# EAGLE schematic Ubo_side_v1.4 (EAGLE 9.6.2)
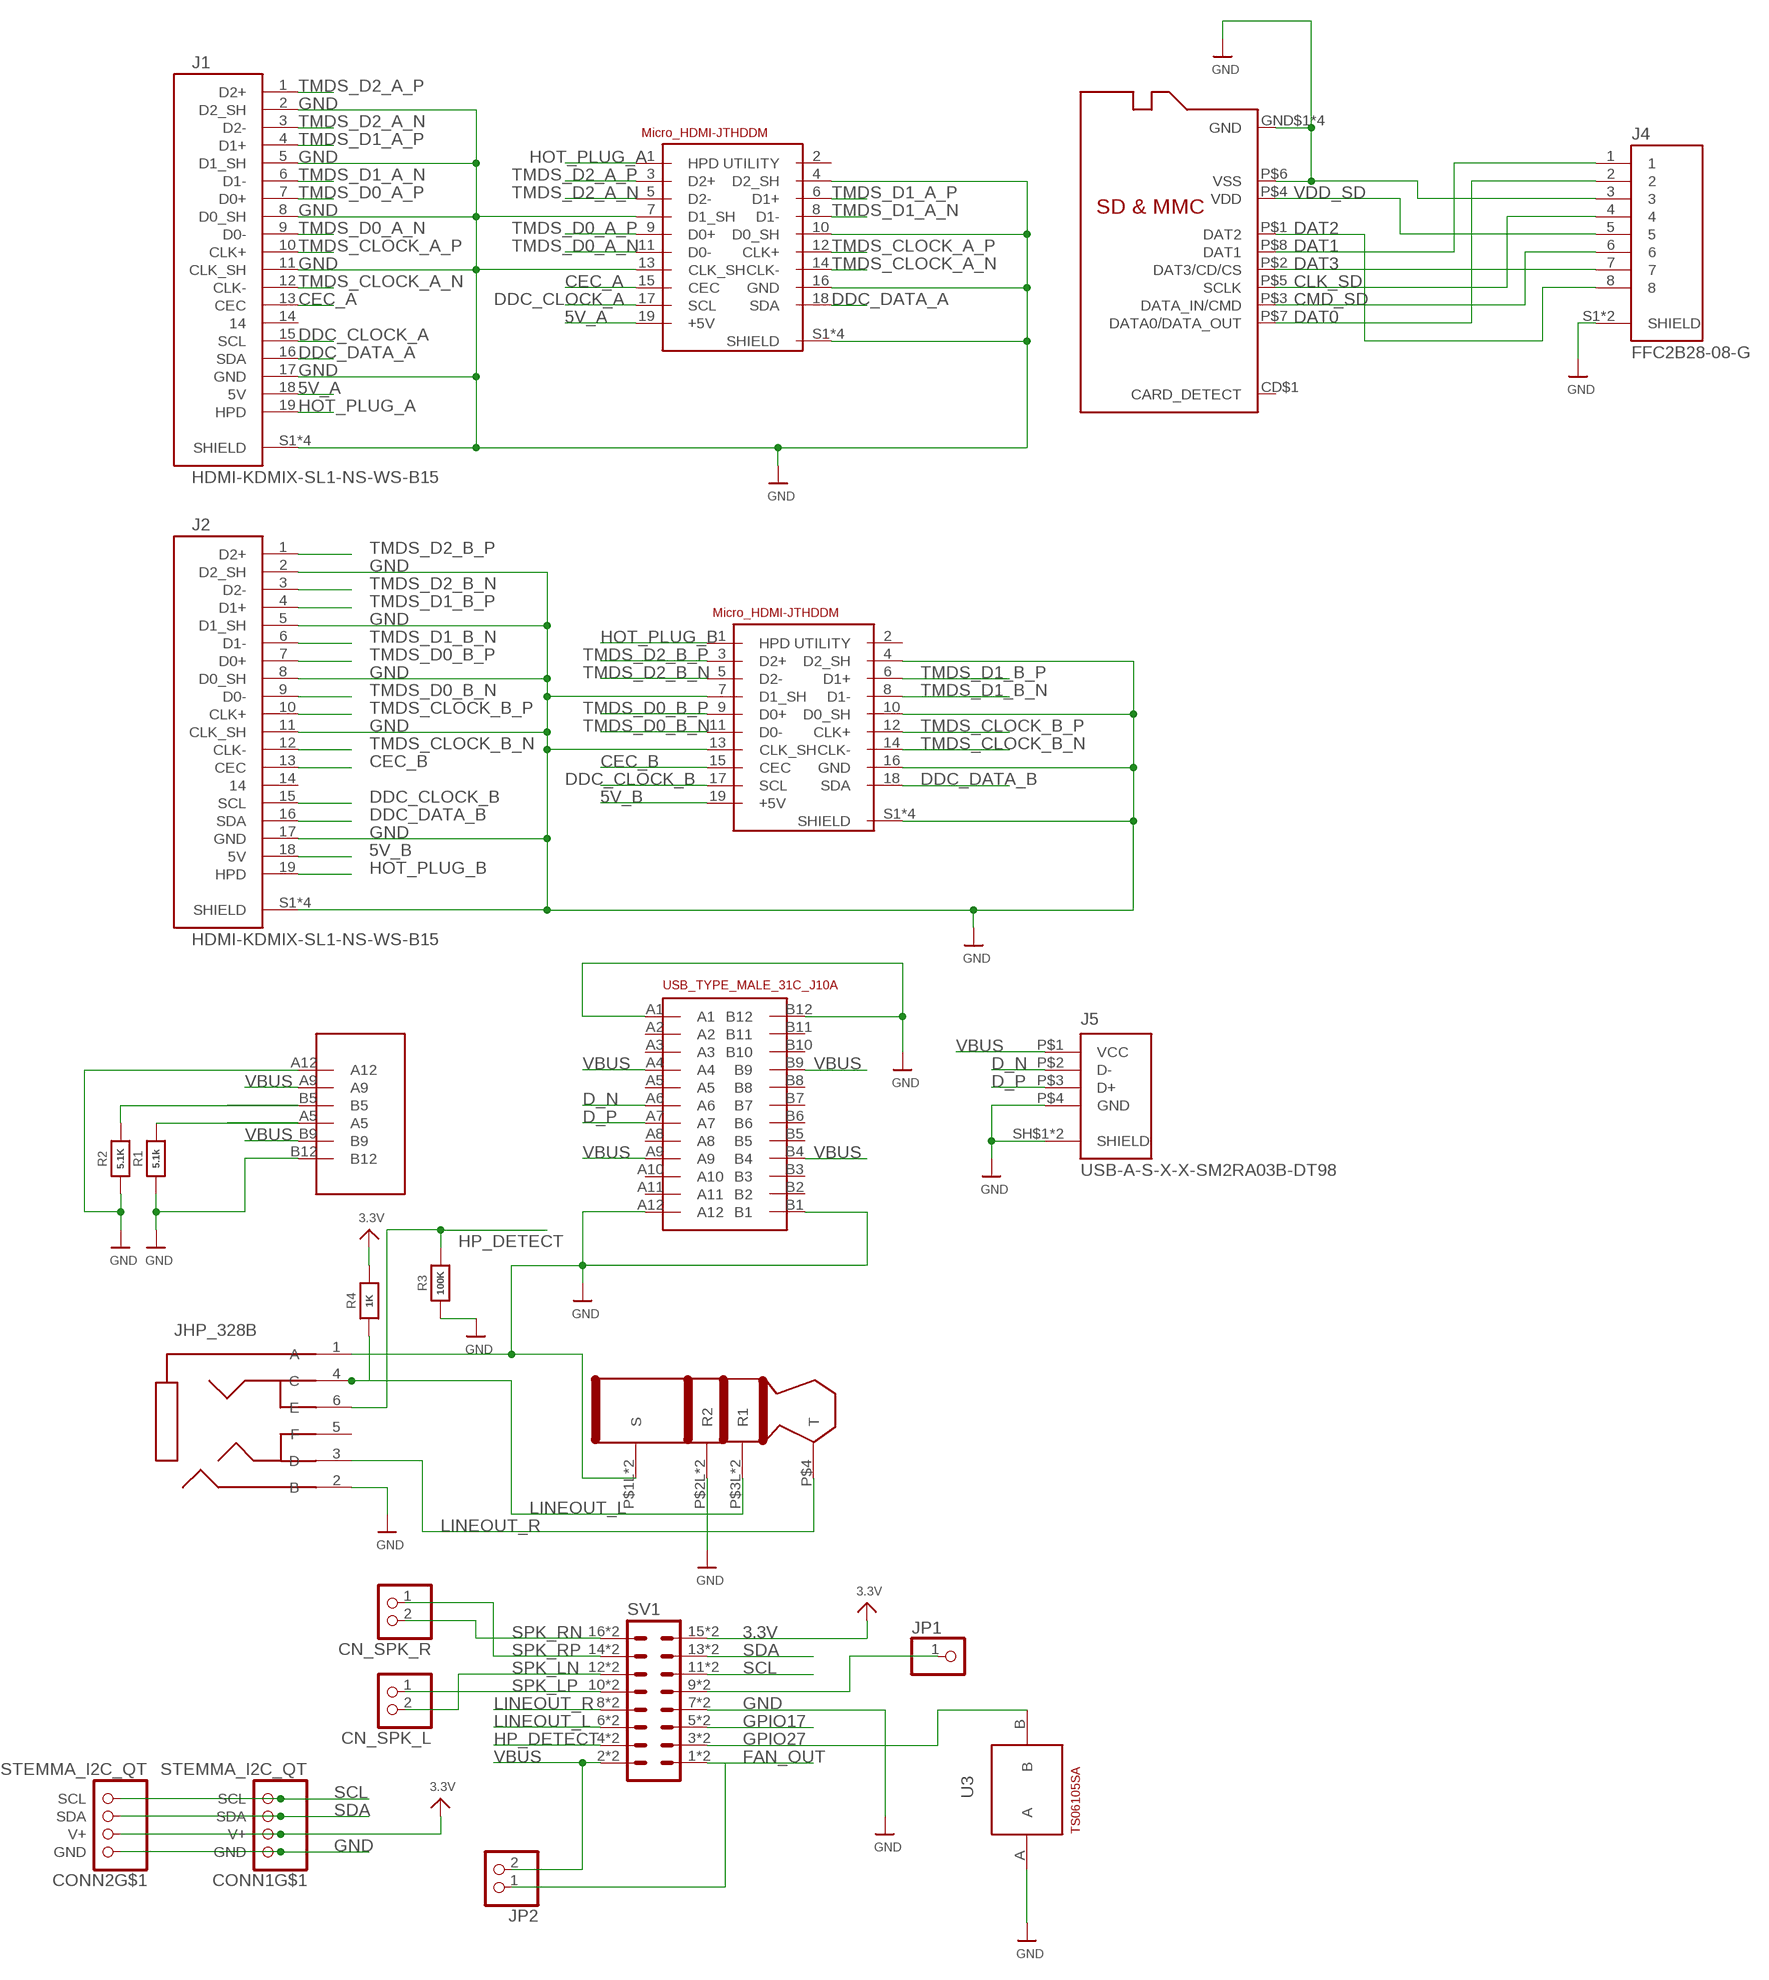
[diagram p0: schematic, sheet 1]

## Parts
AUD_CON  AUDIO_3.5MMJACK_MALE  [AUDIO_3.5MM_JACK_MALE]
CN_SPK_L  JST_2PIN-SMT  [JST-PH-2-SMT]
CN_SPK_R  JST_2PIN-SMT  [JST-PH-2-SMT]
CONN1  STEMMA_I2C_QT  [JST_SH4]
CONN2  STEMMA_I2C_QT  [JST_SH4]
J1  HDMI-KDMIX-SL1-NS-WS-B15  [CONN_KDMIX-SL1-NS-WS-B15]
J2  HDMI-KDMIX-SL1-NS-WS-B15  [CONN_KDMIX-SL1-NS-WS-B15]
J4  FFC2B28-08-G  [GCT_FFC2B28-08-G]
J5  USB-A-S-X-X-SM2RA03B-DT98  [USB-A-RA03B-DT98]
JP1  PINHD-1X1  [1X01]
JP2  PINHD-1X2/90  [1X02/90]
MICROHDMI1  MICRO_HDMI_JTHDDM  [MICRO_HDMI_JTHDDM]
MICROHDMI2  MICRO_HDMI_JTHDDM  [MICRO_HDMI_JTHDDM]
R1  5.1k  RESISTOR_0603  [_0603]
R2  5.1K  RESISTOR_0603  [_0603]
R3  100K  RESISTOR_0603  [_0603]
R4  1K  RESISTOR_0603  [_0603]
SV1  MA08X2-FEMALE  [MA08X2-FEMALE]
U1  AUDIO_SOCKET_JHP_328BPJ-3160  [PJ-3160]
U2  USB-20C-F-06CD-1  [USB_20C_F_60CD]
U3  TS06105SA  [TS-06105SA-1]
U4  MICROSDTF01-H1.8  [MICROSDTF-01-H1.8]
USBC  USB_TYPE_MALE_31C_J10C  [USB_TYPE_MALE_31C_J10A]

## Nets
3.3V: CONN1.2(V+) CONN2.2(V+) R4.2 SV1.15 SV1.P$15
5V_A: J1.18(5V) MICROHDMI1.19(+5V)
5V_B: J2.18(5V) MICROHDMI2.19(+5V)
A5: R1.2 U2.A5
B5: R2.2 U2.B5
CEC_A: J1.13(CEC) MICROHDMI1.15(CEC)
CEC_B: J2.13(CEC) MICROHDMI2.15(CEC)
CLK_SD [SD CARD]: J4.4 U4.P$5(SCLK)
CMD_SD [SD CARD]: J4.6 U4.P$3(DATA_IN/CMD)
D_N: J5.P$2(D-) USBC.A6
D_P: J5.P$3(D+) USBC.A7
DAT0 [SD CARD]: J4.2 U4.P$7(DATA0/DATA_OUT)
DAT1 [SD CARD]: J4.1 U4.P$8(DAT1)
DAT2 [SD CARD]: J4.8 U4.P$1(DAT2)
DAT3 [SD CARD]: J4.7 U4.P$2(DAT3/CD/CS)
DDC_CLOCK_A: J1.15(SCL) MICROHDMI1.17(SCL)
DDC_CLOCK_B: J2.15(SCL) MICROHDMI2.17(SCL)
DDC_DATA_A: J1.16(SDA) MICROHDMI1.18(SDA)
DDC_DATA_B: J2.16(SDA) MICROHDMI2.18(SDA)
FAN_OUT: JP2.1 SV1.1 SV1.P$1
GND: AUD_CON.P$1L(S) AUD_CON.P$1R(S) AUD_CON.P$2L(R2) AUD_CON.P$2R(R2) CONN1.1(GND) CONN2.1(GND) J1.2(D2_SH) J1.5(D1_SH) J1.8(D0_SH) J1.11(CLK_SH) J1.17(GND) J1.S1(SHIELD) J1.S2(SHIELD) J1.S3(SHIELD) J1.S4(SHIELD) J2.2(D2_SH) J2.5(D1_SH) J2.8(D0_SH) J2.11(CLK_SH) J2.17(GND) J2.S1(SHIELD) J2.S2(SHIELD) J2.S3(SHIELD) J2.S4(SHIELD) J4.3 J4.S1(SHIELD) J4.S2(SHIELD) J5.P$4(GND) J5.SH$1(SHIELD) J5.SH$2(SHIELD) MICROHDMI1.4(D2_SH) MICROHDMI1.7(D1_SH) MICROHDMI1.10(D0_SH) MICROHDMI1.13(CLK_SH) MICROHDMI1.16(GND) MICROHDMI1.S1(SHIELD) MICROHDMI1.S2(SHIELD) MICROHDMI1.S3(SHIELD) MICROHDMI1.S4(SHIELD) MICROHDMI2.4(D2_SH) MICROHDMI2.7(D1_SH) MICROHDMI2.10(D0_SH) MICROHDMI2.13(CLK_SH) MICROHDMI2.16(GND) MICROHDMI2.S1(SHIELD) MICROHDMI2.S2(SHIELD) MICROHDMI2.S3(SHIELD) MICROHDMI2.S4(SHIELD) R1.1 R2.1 R3.1 SV1.7 SV1.P$7 U1.1(A) U1.2(B) U2.A12 U2.B12 U3.A U4.GND$1(GND) U4.GND$2(GND) U4.GND$3(GND) U4.GND$4(GND) U4.P$6(VSS) USBC.A1 USBC.A12 USBC.B1 USBC.B12
GPIO17: SV1.5 SV1.P$5
GPIO27: SV1.3 SV1.P$3 U3.B
HOT_PLUG_A: J1.19(HPD) MICROHDMI1.1(HPD)
HOT_PLUG_B: J2.19(HPD) MICROHDMI2.1(HPD)
HP_DETECT: R3.2 SV1.4 SV1.P$4 U1.6(E)
LINEOUT_L: AUD_CON.P$3L(R1) AUD_CON.P$3R(R1) R4.1 SV1.6 SV1.P$6 U1.4(C)
LINEOUT_R: AUD_CON.P$4(T) SV1.8 SV1.P$8 U1.3(D)
N$1: JP1.1 SV1.9 SV1.P$9
SCL: CONN1.4(SCL) CONN2.4(SCL) SV1.11 SV1.P$11
SDA: CONN1.3(SDA) CONN2.3(SDA) SV1.13 SV1.P$13
SPK_LN: CN_SPK_L.2 SV1.12 SV1.P$12
SPK_LP: CN_SPK_L.1 SV1.10 SV1.P$10
SPK_RN: CN_SPK_R.2 SV1.16 SV1.P$16
SPK_RP: CN_SPK_R.1 SV1.14 SV1.P$14
TMDS_CLOCK_A_N: J1.12(CLK-) MICROHDMI1.14(CLK-)
TMDS_CLOCK_A_P: J1.10(CLK+) MICROHDMI1.12(CLK+)
TMDS_CLOCK_B_N: J2.12(CLK-) MICROHDMI2.14(CLK-)
TMDS_CLOCK_B_P: J2.10(CLK+) MICROHDMI2.12(CLK+)
TMDS_D0_A_N: J1.9(D0-) MICROHDMI1.11(D0-)
TMDS_D0_A_P: J1.7(D0+) MICROHDMI1.9(D0+)
TMDS_D0_B_N: J2.9(D0-) MICROHDMI2.11(D0-)
TMDS_D0_B_P: J2.7(D0+) MICROHDMI2.9(D0+)
TMDS_D1_A_N: J1.6(D1-) MICROHDMI1.8(D1-)
TMDS_D1_A_P: J1.4(D1+) MICROHDMI1.6(D1+)
TMDS_D1_B_N: J2.6(D1-) MICROHDMI2.8(D1-)
TMDS_D1_B_P: J2.4(D1+) MICROHDMI2.6(D1+)
TMDS_D2_A_N: J1.3(D2-) MICROHDMI1.5(D2-)
TMDS_D2_A_P: J1.1(D2+) MICROHDMI1.3(D2+)
TMDS_D2_B_N: J2.3(D2-) MICROHDMI2.5(D2-)
TMDS_D2_B_P: J2.1(D2+) MICROHDMI2.3(D2+)
VBUS: J5.P$1(VCC) JP2.2 SV1.2 SV1.P$2 U2.A9 U2.B9 USBC.A4 USBC.A9 USBC.B4 USBC.B9
VDD_SD: J4.5 U4.P$4(VDD)
Unconnected: CONN1.MT1(MT) CONN1.MT2(MT) CONN2.MT1(MT) CONN2.MT2(MT) J1.14 J2.14 MICROHDMI1.2(UTILITY) MICROHDMI2.2(UTILITY) U1.5(F) U4.CD$1(CARD_DETECT) USBC.A2 USBC.A3 USBC.A5 USBC.A8 USBC.A10 USBC.A11 USBC.B2 USBC.B3 USBC.B5 USBC.B6 USBC.B7 USBC.B8 USBC.B10 USBC.B11

## Library data of the parts
AUD_CON = Uno:AUDIO_3.5MMJACK_MALE
CN_SPK_L CN_SPK_R = Uno:JST_2PIN: JST 2-Pin Connectors of various flavors SMT-RA (S2B-PH-SM4) 4UConnector #17311 SMT (B2B-PH-SM4) THM-RA (S2B-PH) THM (B2B-PH)
CONN1 CONN2 = Uno:STEMMA_I2C
J1 J2 = Uno:HDMI-KDMIX-SL1-NS-WS-B15: Conn HDMI RCP 19 POS 1.15mm Solder RA Thru-Hole 19 Terminal 1 Port; COST: $0.4; DESCRIPTION: HDMI Receptacle Connector 19 Position Through Hole, Right Angle; DIGI-KEY_PART_NUMBER: 2092-KDMIX-SL1-NS-WS-B15-ND; MF: Kycon; MF-ALT: Xiamen Jibeili Electronics; MP: KDMIX-SL1-NS-WS-B15; PACKAGE: None
J4 = Uno:FFC2B28-08-G: FPC 0.5mm Pitch, Side entry, Dual contact, SMT, Height 1mm, Back Flip Check prices <https://pricing.snapeda.com/parts/FFC2B28-08-G/Global%20Connector%20Technology/view-part?ref=eda>; AVAILABILITY: In Stock; DESCRIPTION: 8 Position FFC, FPC Connector Contacts, Top and Bottom 0.020 (0.50mm) Surface Mount, Right Angle; MF: Global Connector Technology; MP: FFC2B28-08-G; PACKAGE: None; PRICE: None; PURCHASE-URL: https://pricing.snapeda.com/search/part/FFC2B28-08-G/?ref=eda
J5 = Uno:USB-A-S-X-X-SM2: USB-A (USB TYPE-A) USB 2.0 Receptacle Connector 4 Position Surface Mount, Right Angle; Through Hole
JP1 = adafruit:PINHD-1X1: Pin header 1x1 for 0.1" spacing With round pins
JP2 = pinhead:PINHD-1X2: PIN HEADER
MICROHDMI1 MICROHDMI2 = Uno:MICRO_HDMI_JTHDDM: Micro HDMI Male connector, 19 Pins, Board Edge Mount; MF: MTCONN ELECTRONICS CO.,LTD; MPN: JTHDDM_0200D1SP79
R1-R4 = Uno:RESISTOR: Resistors For new designs, use the packages preceded by an '_' character since they are more reliable: The following footprints should be used on most boards: _0402 - Standard footprint for regular board layouts _0603 - Standard footprint for regular board layouts _0805 - Standard footprint for regular board layouts _1206 - Standard footprint for regular board layouts For extremely tight-pitch boards where space is at a premium, the following 'micro-pitch' footprints can be used (smaller pads, no silkscreen outline, etc.): _0402MP - Micro-pitch footprint for very dense/compact boards _0603MP - Micro-pitch footprint for very dense/compact boards _0805MP - Micro-pitch footprint for very dense/compact boards _1206MP - Micro-pitch footprint for very dense/compact boards
SV1 = Uno:MA08X2-FEMALE: PIN HEADER
U1 = Uno:AUDIO_SOCKET_JHP_328B: 3.50mm (0.141", 1/8", Mini Plug) - Headphone Phone Jack Stereo (4 Conductor, TRRS) Connector Solder
U2 = Uno:USB-20C-F-06CD-1
U3 = Uno:TS06105SA
U4 = Uno:MICROSD: Micro-SD / Transflash card holder with SPI pinout For the 3M # 2908-05WB-MG and/or 4UCON #19656 push-push type
USBC = Uno:USB_TYPE_MALE_31C_J10C: Male USB Type C connector, 24 pins, Board Edge Connect (Right Angle); MF: XIAMEN JINBEILI ELECTRONICS CO.,LTD; MPN: USB_31C_M_J10A

## Net classes
1 SD CARD: width 0.305 mm